# Altium schematic sheet Z7_FUNCTION1.SchDoc
size A3
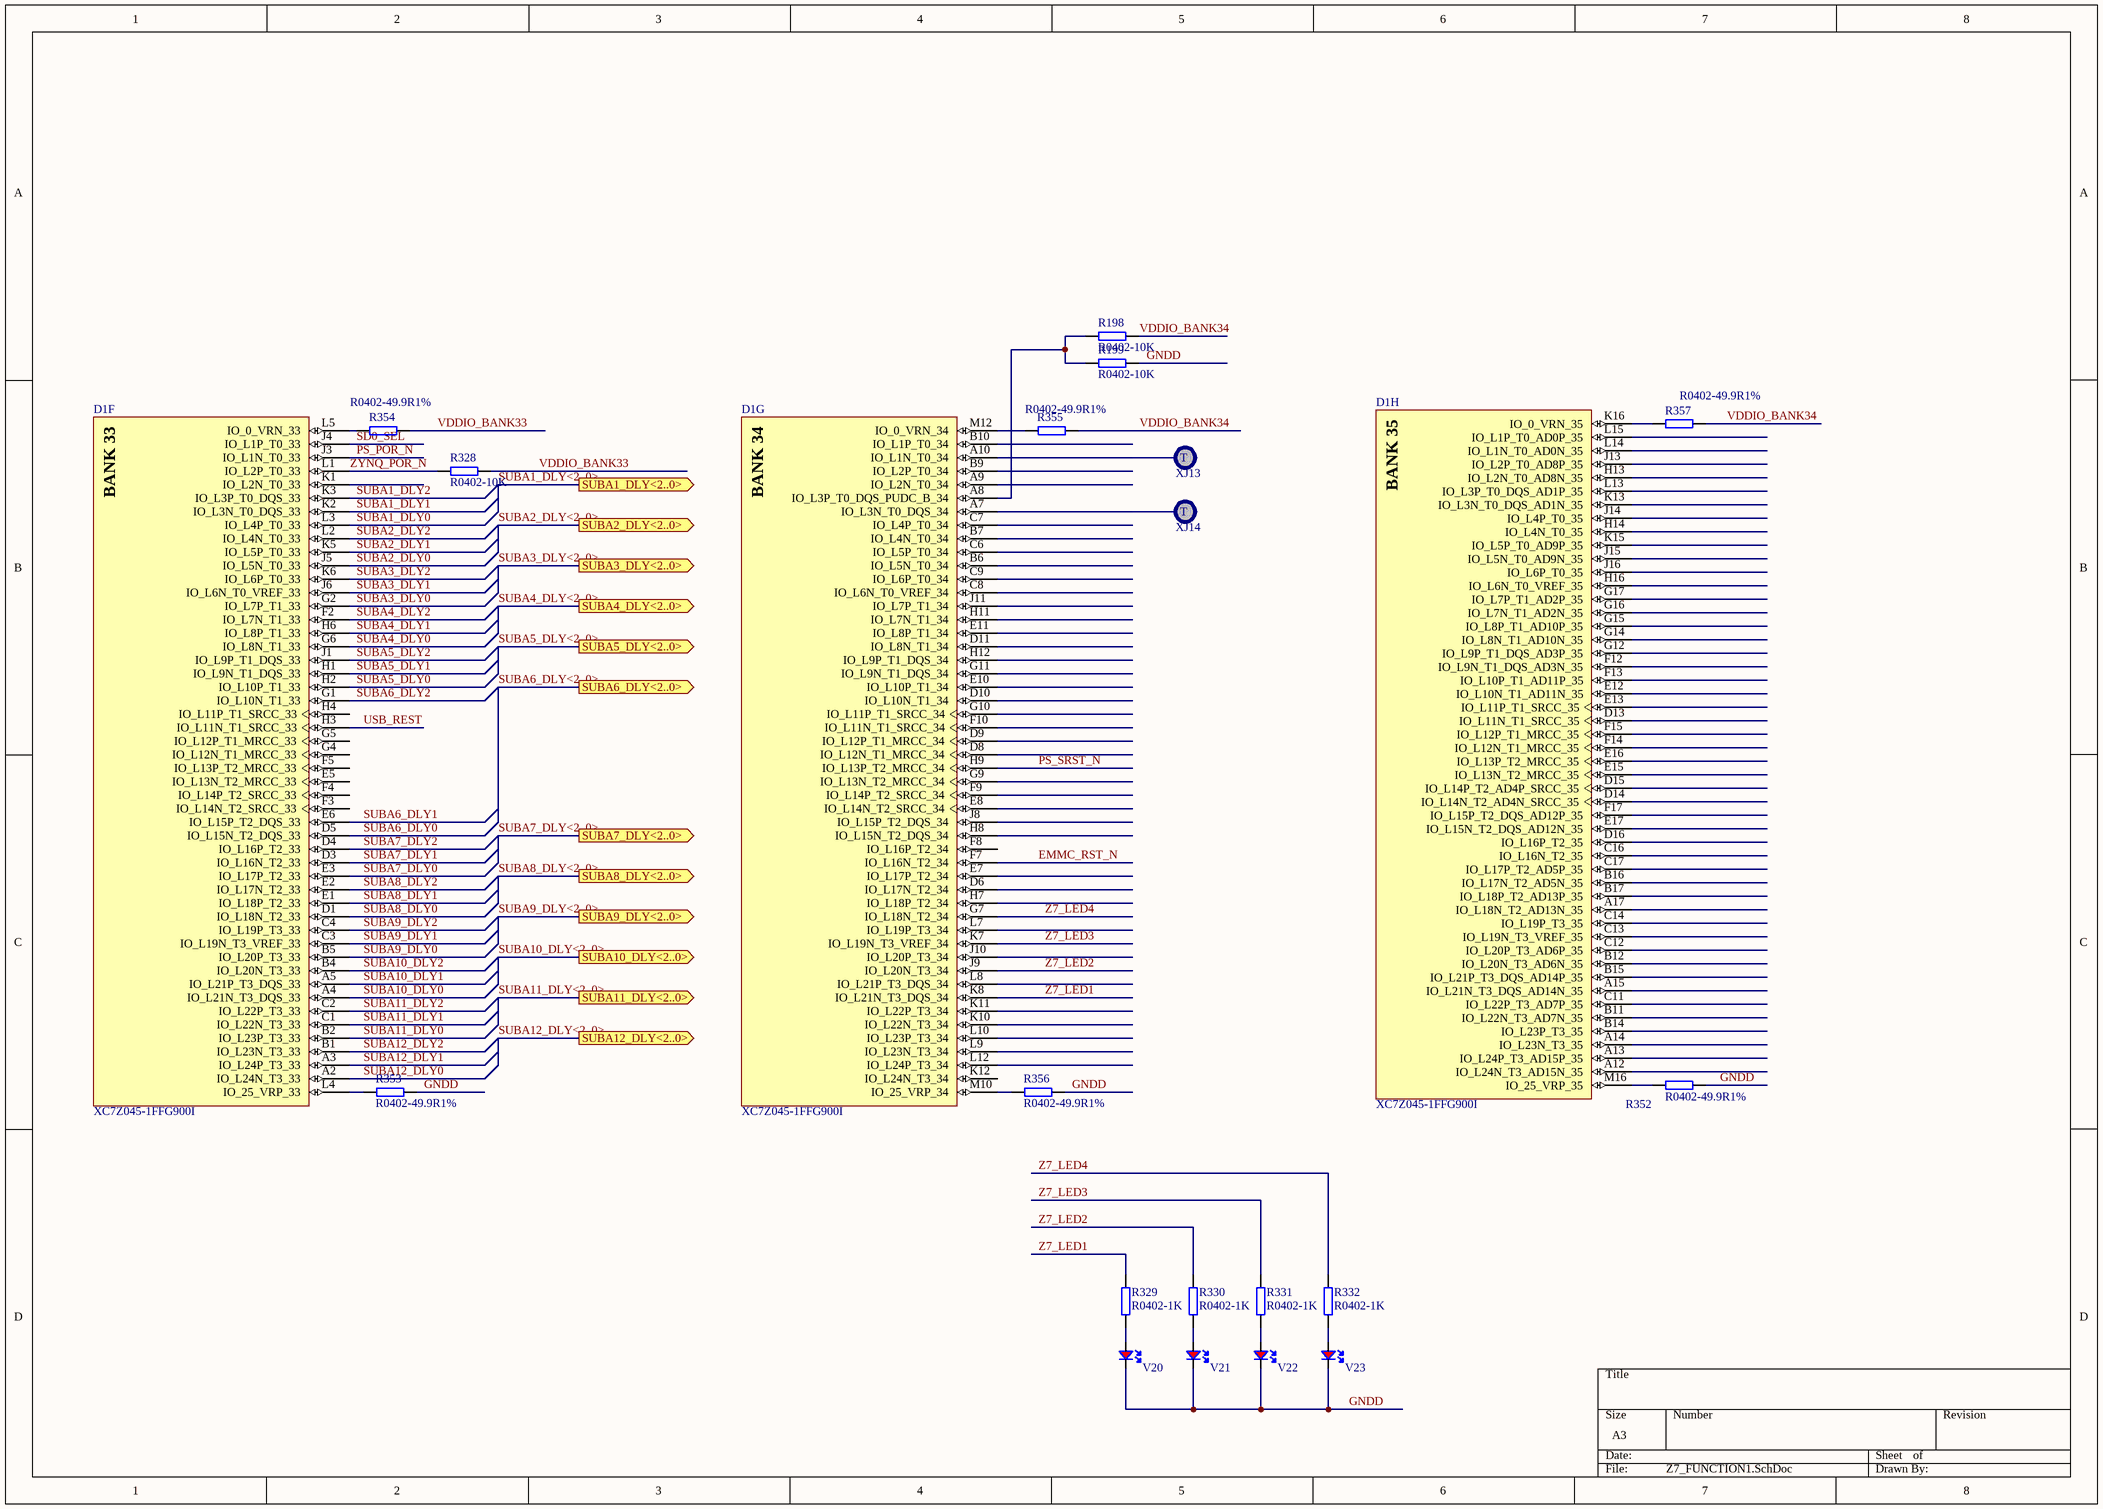
[diagram p0: Z7_FUNCTION1.SchDoc]

## Parts
D1  XC7Z045-1FFG900I  [FFG900]  (parts F,G,H of 16)
R198  R0402-10K  [R0402]
R199  R0402-10K  [R0402]
R328  R0402-10K  [R0402]
R329  R0402-1K  [R0402]
R330  R0402-1K  [R0402]
R331  R0402-1K  [R0402]
R332  R0402-1K  [R0402]
R352  R0402-49.9R1%  [R0402]
R353  R0402-49.9R1%  [R0402]
R354  R0402-49.9R1%  [R0402]
R355  R0402-49.9R1%  [R0402]
R356  R0402-49.9R1%  [R0402]
R357  R0402-49.9R1%  [R0402]
V20  LED-R0603  [LED-R0603]  (value not drawn)
V21  LED-R0603  [LED-R0603]  (value not drawn)
V22  LED-R0603  [LED-R0603]  (value not drawn)
V23  LED-R0603  [LED-R0603]  (value not drawn)
XJ13  TESTPOINT  [TEST-pin]  (value not drawn)
XJ14  TESTPOINT  [TEST-pin]  (value not drawn)

## Ports
SUBA1_DLY<2..0> (out), SUBA2_DLY<2..0> (out), SUBA3_DLY<2..0> (out), SUBA4_DLY<2..0> (out), SUBA5_DLY<2..0> (out), SUBA6_DLY<2..0> (out), SUBA7_DLY<2..0> (out), SUBA8_DLY<2..0> (out), SUBA9_DLY<2..0> (out), SUBA10_DLY<2..0> (out), SUBA11_DLY<2..0> (out), SUBA12_DLY<2..0> (out)

## Nets
EMMC_RST_N: D1.F7(IO_L16N_T2_34)
GNDD: R199.2 R352.2 R353.2 R356.2 V20.2(K) V21.2(K) V22.2(K) V23.2(K)
PS_POR_N: D1.J3(IO_L1N_T0_33)
PS_SRST_N: D1.H9(IO_L13P_T2_MRCC_34)
SD0_SEL: D1.J4(IO_L1P_T0_33)
SUBA1_DLY0: D1.L3(IO_L4P_T0_33)
SUBA1_DLY1: D1.K2(IO_L3N_T0_DQS_33)
SUBA1_DLY2: D1.K3(IO_L3P_T0_DQS_33)
SUBA2_DLY0: D1.J5(IO_L5N_T0_33)
SUBA2_DLY1: D1.K5(IO_L5P_T0_33)
SUBA2_DLY2: D1.L2(IO_L4N_T0_33)
SUBA3_DLY0: D1.G2(IO_L7P_T1_33)
SUBA3_DLY1: D1.J6(IO_L6N_T0_VREF_33)
SUBA3_DLY2: D1.K6(IO_L6P_T0_33)
SUBA4_DLY0: D1.G6(IO_L8N_T1_33)
SUBA4_DLY1: D1.H6(IO_L8P_T1_33)
SUBA4_DLY2: D1.F2(IO_L7N_T1_33)
SUBA5_DLY0: D1.H2(IO_L10P_T1_33)
SUBA5_DLY1: D1.H1(IO_L9N_T1_DQS_33)
SUBA5_DLY2: D1.J1(IO_L9P_T1_DQS_33)
SUBA6_DLY0: D1.D5(IO_L15N_T2_DQS_33)
SUBA6_DLY1: D1.E6(IO_L15P_T2_DQS_33)
SUBA6_DLY2: D1.G1(IO_L10N_T1_33)
SUBA7_DLY0: D1.E3(IO_L17P_T2_33)
SUBA7_DLY1: D1.D3(IO_L16N_T2_33)
SUBA7_DLY2: D1.D4(IO_L16P_T2_33)
SUBA8_DLY0: D1.D1(IO_L18N_T2_33)
SUBA8_DLY1: D1.E1(IO_L18P_T2_33)
SUBA8_DLY2: D1.E2(IO_L17N_T2_33)
SUBA9_DLY0: D1.B5(IO_L20P_T3_33)
SUBA9_DLY1: D1.C3(IO_L19N_T3_VREF_33)
SUBA9_DLY2: D1.C4(IO_L19P_T3_33)
SUBA10_DLY0: D1.A4(IO_L21N_T3_DQS_33)
SUBA10_DLY1: D1.A5(IO_L21P_T3_DQS_33)
SUBA10_DLY2: D1.B4(IO_L20N_T3_33)
SUBA11_DLY0: D1.B2(IO_L23P_T3_33)
SUBA11_DLY1: D1.C1(IO_L22N_T3_33)
SUBA11_DLY2: D1.C2(IO_L22P_T3_33)
SUBA12_DLY0: D1.A2(IO_L24N_T3_33)
SUBA12_DLY1: D1.A3(IO_L24P_T3_33)
SUBA12_DLY2: D1.B1(IO_L23N_T3_33)
USB_REST: D1.H3(IO_L11N_T1_SRCC_33)
VDDIO_BANK33: R328.1 R354.2
VDDIO_BANK34: R198.2 R355.2 R357.2
Z7_LED1: D1.K8(IO_L21N_T3_DQS_34) R329.2
Z7_LED2: D1.J9(IO_L20N_T3_34) R330.2
Z7_LED3: D1.K7(IO_L19N_T3_VREF_34) R331.2
Z7_LED4: D1.G7(IO_L18N_T2_34) R332.2
ZYNQ_POR_N: D1.L1(IO_L2P_T0_33) R328.2
NetD1_A7: D1.A7(IO_L3N_T0_DQS_34) XJ14.1(T)
NetD1_A8: D1.A8(IO_L3P_T0_DQS_PUDC_B_34) R198.1 R199.1
NetD1_A10: D1.A10(IO_L1N_T0_34) XJ13.1(T)
NetD1_K16: D1.K16(IO_0_VRN_35) R357.1
NetD1_L4: D1.L4(IO_25_VRP_33) R353.1
NetD1_L5: D1.L5(IO_0_VRN_33) R354.1
NetD1_M10: D1.M10(IO_25_VRP_34) R356.1
NetD1_M12: D1.M12(IO_0_VRN_34) R355.1
NetD1_M16: D1.M16(IO_25_VRP_35) R352.1
NetR329_1: R329.1 V20.1(A)
NetR330_1: R330.1 V21.1(A)
NetR331_1: R331.1 V22.1(A)
NetR332_1: R332.1 V23.1(A)

Not connected (* = marked no-connect by the designer): D1 A9(IO_L2N_T0_34) A12(IO_L24N_T3_AD15N_35) A13(IO_L24P_T3_AD15P_35) A14(IO_L23N_T3_35) A15(IO_L21N_T3_DQS_AD14N_35) A17(IO_L18N_T2_AD13N_35) B6(IO_L5N_T0_34) B7(IO_L4N_T0_34) B9(IO_L2P_T0_34) B10(IO_L1P_T0_34) B11(IO_L22N_T3_AD7N_35) B12(IO_L20N_T3_AD6N_35) B14(IO_L23P_T3_35) B15(IO_L21P_T3_DQS_AD14P_35) B16(IO_L17N_T2_AD5N_35) B17(IO_L18P_T2_AD13P_35) C6(IO_L5P_T0_34) C7(IO_L4P_T0_34) C8(IO_L6N_T0_VREF_34) C9(IO_L6P_T0_34) C11(IO_L22P_T3_AD7P_35) C12(IO_L20P_T3_AD6P_35) C13(IO_L19N_T3_VREF_35) C14(IO_L19P_T3_35) C16(IO_L16N_T2_35) C17(IO_L17P_T2_AD5P_35) D6(IO_L17N_T2_34) D8(IO_L12N_T1_MRCC_34) D9(IO_L12P_T1_MRCC_34) D10(IO_L10N_T1_34) D11(IO_L8N_T1_34) D13(IO_L11N_T1_SRCC_35) D14(IO_L14N_T2_AD4N_SRCC_35) D15(IO_L14P_T2_AD4P_SRCC_35) D16(IO_L16P_T2_35) E5(IO_L13N_T2_MRCC_33) E7(IO_L17P_T2_34) E8(IO_L14N_T2_SRCC_34) E10(IO_L10P_T1_34) E11(IO_L8P_T1_34) E12(IO_L10N_T1_AD11N_35) E13(IO_L11P_T1_SRCC_35) E15(IO_L13N_T2_MRCC_35) E16(IO_L13P_T2_MRCC_35) E17(IO_L15N_T2_DQS_AD12N_35) F3(IO_L14N_T2_SRCC_33) F4(IO_L14P_T2_SRCC_33) F5(IO_L13P_T2_MRCC_33) F8(IO_L16P_T2_34) F9(IO_L14P_T2_SRCC_34) F10(IO_L11N_T1_SRCC_34) F12(IO_L9N_T1_DQS_AD3N_35) F13(IO_L10P_T1_AD11P_35) F14(IO_L12N_T1_MRCC_35) F15(IO_L12P_T1_MRCC_35) F17(IO_L15P_T2_DQS_AD12P_35) G4(IO_L12N_T1_MRCC_33) G5(IO_L12P_T1_MRCC_33) G9(IO_L13N_T2_MRCC_34) G10(IO_L11P_T1_SRCC_34) G11(IO_L9N_T1_DQS_34) G12(IO_L9P_T1_DQS_AD3P_35) G14(IO_L8N_T1_AD10N_35) G15(IO_L8P_T1_AD10P_35) G16(IO_L7N_T1_AD2N_35) G17(IO_L7P_T1_AD2P_35) H4(IO_L11P_T1_SRCC_33) H7(IO_L18P_T2_34) H8(IO_L15N_T2_DQS_34) H11(IO_L7N_T1_34) H12(IO_L9P_T1_DQS_34) H13(IO_L2N_T0_AD8N_35) H14(IO_L4N_T0_35) H16(IO_L6N_T0_VREF_35) J8(IO_L15P_T2_DQS_34) J10(IO_L20P_T3_34) J11(IO_L7P_T1_34) J13(IO_L2P_T0_AD8P_35) J14(IO_L4P_T0_35) J15(IO_L5N_T0_AD9N_35) J16(IO_L6P_T0_35) K1(IO_L2N_T0_33) K10(IO_L22N_T3_34) K11(IO_L22P_T3_34) K12(IO_L24N_T3_34) K13(IO_L3N_T0_DQS_AD1N_35) K15(IO_L5P_T0_AD9P_35) L7(IO_L19P_T3_34) L8(IO_L21P_T3_DQS_34) L9(IO_L23N_T3_34) L10(IO_L23P_T3_34) L12(IO_L24P_T3_34) L13(IO_L3P_T0_DQS_AD1P_35) L14(IO_L1N_T0_AD0N_35) L15(IO_L1P_T0_AD0P_35)

## Buses and harness runs
bus SUBA1_DLY<2..0> = port SUBA1_DLY<2..0>
bus SUBA2_DLY<2..0> = port SUBA2_DLY<2..0>
bus SUBA3_DLY<2..0> = port SUBA3_DLY<2..0>
bus SUBA4_DLY<2..0> = port SUBA4_DLY<2..0>
bus SUBA5_DLY<2..0> = port SUBA5_DLY<2..0>
bus SUBA6_DLY<2..0> = port SUBA6_DLY<2..0>
bus SUBA7_DLY<2..0> = port SUBA7_DLY<2..0>
bus SUBA8_DLY<2..0> = port SUBA8_DLY<2..0>
bus SUBA9_DLY<2..0> = port SUBA9_DLY<2..0>
bus SUBA10_DLY<2..0> = port SUBA10_DLY<2..0>
bus SUBA11_DLY<2..0> = port SUBA11_DLY<2..0>
bus SUBA12_DLY<2..0> = port SUBA12_DLY<2..0>

## Notes on the sheet
- (in symbol XC7Z045-1FFG900I, part F) BANK 33
- (in symbol XC7Z045-1FFG900I, part G) BANK 34
- (in symbol XC7Z045-1FFG900I, part H) BANK 35

## Library data of the parts
D1 = XC7Z045-1FFG900I: 667 MHz Zynq?7000 AP SoC, 130 PS I/O, 378 FPGA I/O, 900-Ball BGA, Speed Grade 1, Industrial Grade, Pb-Free; Manufacturer: Xilinx; Extensible Block RAM (# 36Kb Blocks): 2180 KB (545); Flip Flops: 437200; LUTs: 218600; Speed Grade: -1; DatasheetVersion: v1.2; PackageVersion: Rev 1.1; PackageReference: FFG900; PackageDescription: Flip-Chip BGA, Body 31 x 31 mm, 1.0 mm Pitch; Generic Part Number: XC7Z045; RoHS: Pb-Free; Mounting Technology: Surface Mount; Code_JEDEC: MS-034-AAN-1; PartNumber: XC7Z045-1FFG900I; ComponentLink1Description: Datasheet; ComponentLink1URL: http://www.xilinx.com/support/documentation/data_sheets/ds190-Zynq-7000-Overview.pdf; ComponentLink2Description: Package Specification; ComponentLink2URL: http://www.xilinx.com/support/documentation/user_guides/ug865-Zynq-7000-Pkg-Pinout.pdf; ComponentLink3Description: DC and AC Switching Characteristics; ComponentLink3URL: http://www.xilinx.com/support/documentation/data_sheets/ds191-XC7Z030-XC7Z045-data-sheet.pdf; ComponentLink4Description: Package File; ComponentLink4URL: http://www.xilinx.com/support/packagefiles/z7packages/xc7z045ffg900pkg.txt; ComponentLink5Description: Packaging and Pinout; ComponentLink5URL: http://www.xilinx.com/support/documentation/user_guides/ug865-Zynq-7000-Pkg-Pinout.pdf; ComponentLink6Description: PCB and Layout Guide; ComponentLink6URL: http://www.xilinx.com/support/documentation/user_guides/ug483_7Series_PCB.pdf
R198 R199 R328-R332 R352-R357 = R0402-10K: Manufacturer: SAMSUNG; Part_type: RES; Schematic_Part: RES; PCB_Footprint: R0402
  R198 R199 R328: Part_number: R0402-10K; Value: R0402-10K
  R329-R332: Part_number: R0402-1K; Value: R0402-1K
  R352-R357: Part_number: R0402-49.9R1%; Value: R0402-49.9R1%
V20-V23 = LED-R0603: 表贴发光二极管, 0603封装, 体积1.6x0.8mm, 红色, 高度0.8mm; Part_type: DIODES; Part_number: LED-R0603; Value: LED-R0603; Schematic_Part: LED-R; PCB_Footprint: LED-R0603
XJ13 XJ14 = TESTPOINT: 测试点; Part_type: Miscellaneous; Part_number: TESTPOINT; Value: TESTPOINT; Schematic_Part: TESTPOINT; PCB_Footprint: TEST-pin